# EAGLE design B+reg (EAGLE 8.4.0)
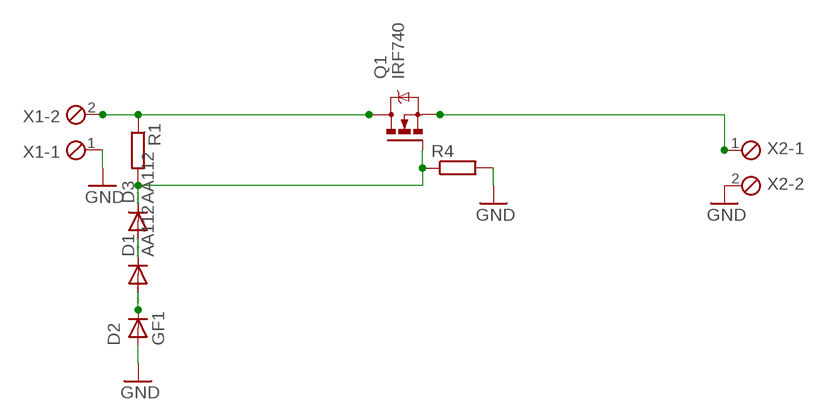
[diagram p0: schematic, sheet 1]

## Parts
D1  AA112  [DO07]
D2  GF1  [SMA-DO214AC]
D3  AA112  [DO07]
Q1  IRF740  [TO220BV]
R1  R-EU_R0805  [R0805]
R4  R-EU_R0805  [R0805]
X1  MPT2  [2POL254]
X2  MPT2  [2POL254]

## Nets
GND: D2.A R4.2 X1.1 X2.2
N$1: D1.A D2.K(C)
N$2: D1.C D3.A
N$3: Q1.D R1.1 X1.2
N$4: D3.C Q1.G R1.2 R4.1
N$5: Q1.S X2.1

## Library data of the parts
D1 D3 = diode:AA112: DIODE germanium
D2 = diode:GF1: DIODE
Q1 = transistor-power:IRF740: N-CHANNEL MOS FET
R1 R4 = rcl:R-EU_: RESISTOR, European symbol
X1 X2 = con-phoenix-254:MPT2: PHOENIX CONNECTOR; OC_FARNELL: unknown; OC_NEWARK: unknown

## Board
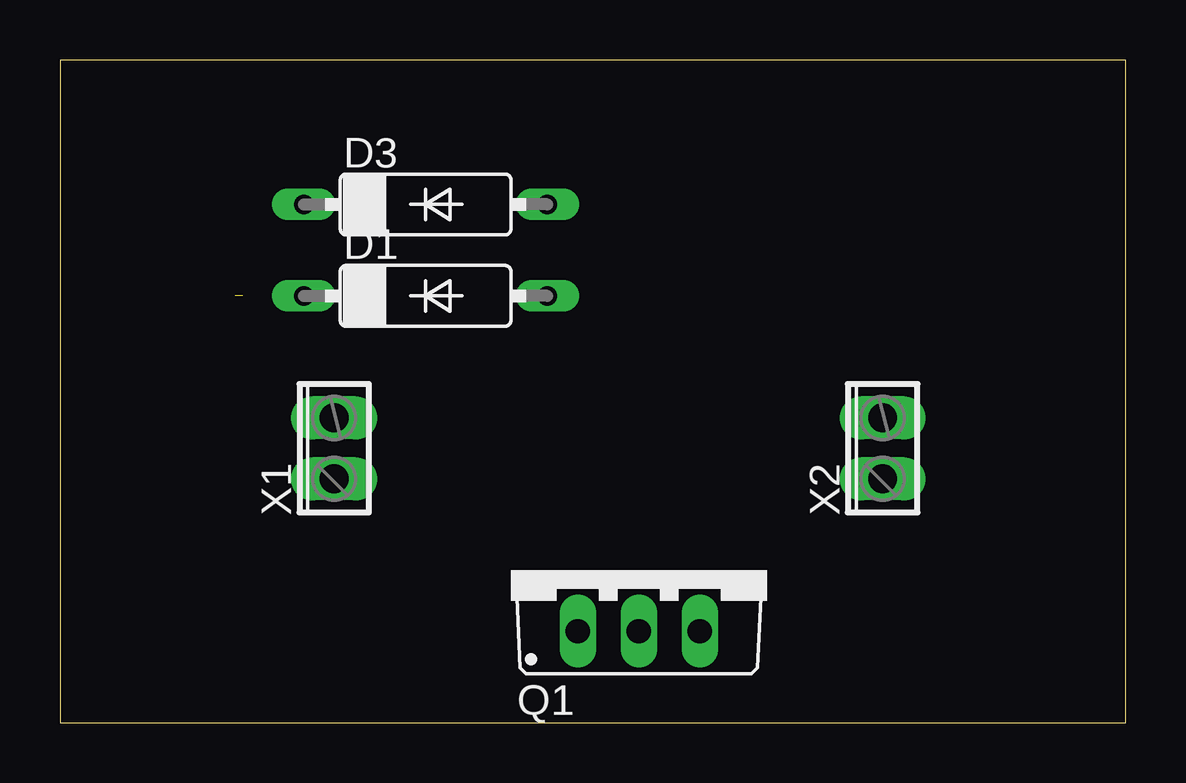
[diagram p1: board, top side]
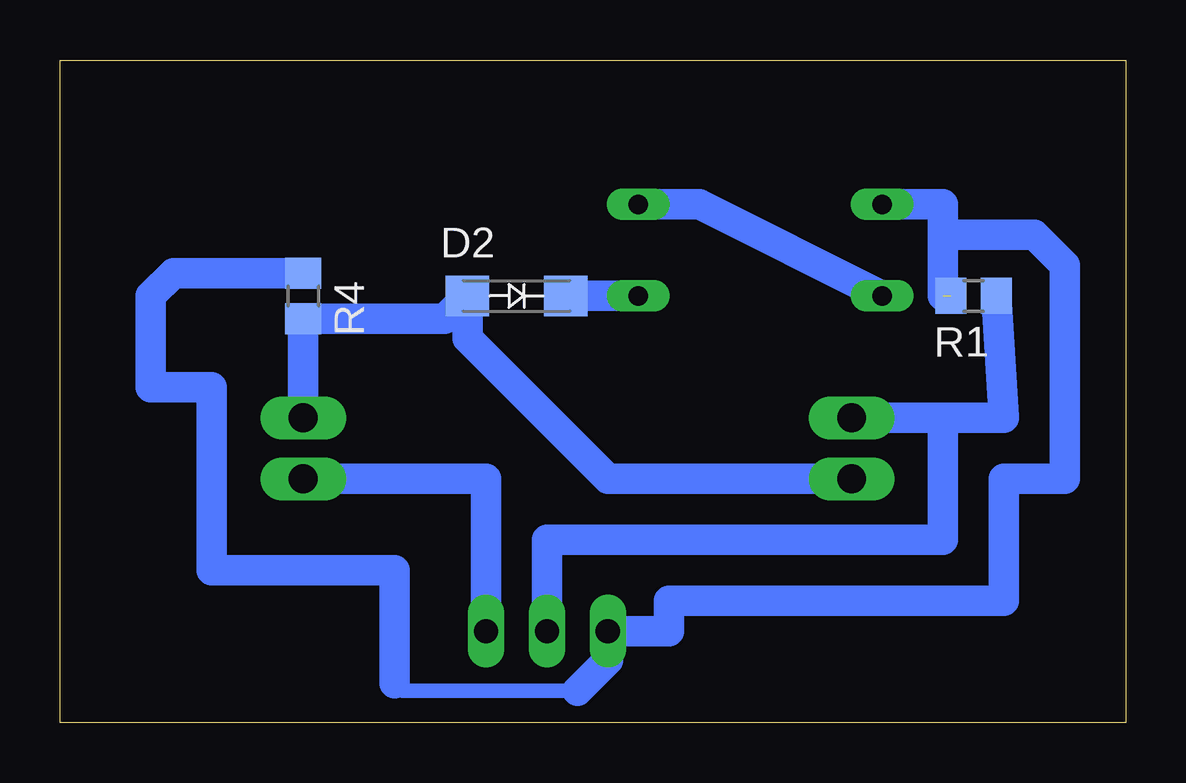
[diagram p2: board, bottom side, seen from below]

Size 44.43 x 27.61 mm. Coordinates in mm from the lower left corner, seen from the top.
Outline: 0,0 44.43,0 44.43,27.61 0,27.61 0,0
Copper layers (1*16): Top 0.035mm / dielectric 1.5mm / Bottom 0.035mm
Design rules "default": minimum track width 6mil, minimum drill 0.35mm, track to track 6mil, track to pad 6mil, pad to pad 6mil, via to via 6mil, smd to smd 6mil, copper to edge 40mil, drill to drill 6mil, minimum pad ring 10mil, minimum via ring 8mil, stop-mask expansion 4mil, vias tented up to drill 0mil, thermal gap 10mil

### Footprints (pad centres in the part's own frame; a part is rotated, then mirrored left to right if it is on the bottom)
DO07 = drill 0.813 long: A 5.08,0; C -5.08,0
SMA-DO214AC = smd 1.8 x 1.7: A -2.05,0; K 2.05,0
TO220BV = drill 1.016 long: D 0,-2.54; G -2.54,-2.54; S 2.54,-2.54
R0805 = smd 1.3 x 1.5: 1 -0.95,0; 2 0.95,0
2POL254 = drill 1.2 long: 1 -1.27,0; 2 1.27,0

### Placement (x,y rotation side)
D1  15.24,17.78 0 top
D2  25.4,17.78 0 bottom
D3  15.24,21.59 0 top
Q1  24.13,6.35 0 top
R1  6.35,17.78 180 bottom
R4  34.29,17.78 270 bottom
X1  11.43,11.43 90 top
X2  34.29,11.43 90 top

### Tracks (layer width: path | path; a pad name or v marks a point on that pad's centre or on a via)
GND
  Bottom 1.27: X2.2 R4.2 28.4,16.83 D2.A 27.45,16.02 21.59,10.16 X1.1
N$1
  Bottom 1.27: D2.K D1.A
N$2
  Bottom 1.27: D1.C 17.78,21.59 D3.A
N$3
  Bottom 1.27: R1.1 5.08,12.7 X1.2 7.62,12.7 7.62,7.62 24.13,7.62 Q1.D
N$4  (1 unrouted)
  Bottom 0.61: 30.48,1.65 30.15,1.32 22.86,1.32
  Bottom 1.27: R4.1 39.69,18.73 40.64,17.78 40.64,13.97 38.1,13.97 38.1,6.35 30.48,6.35 30.48,1.65 | 22.86,1.32 21.59,2.59 Q1.G 19.05,3.81 19.05,5.08 5.08,5.08 5.08,10.16 2.54,10.16 2.54,19.05 3.81,20.32 7.62,20.32 | D3.C 7.62,21.59 7.62,20.32 | 7.62,20.32 7.62,17.78
N$5
  Bottom 1.27: X2.1 26.67,10.16 Q1.S